# EAGLE schematic Goethe_Stromfluss (EAGLE 7.7.0)
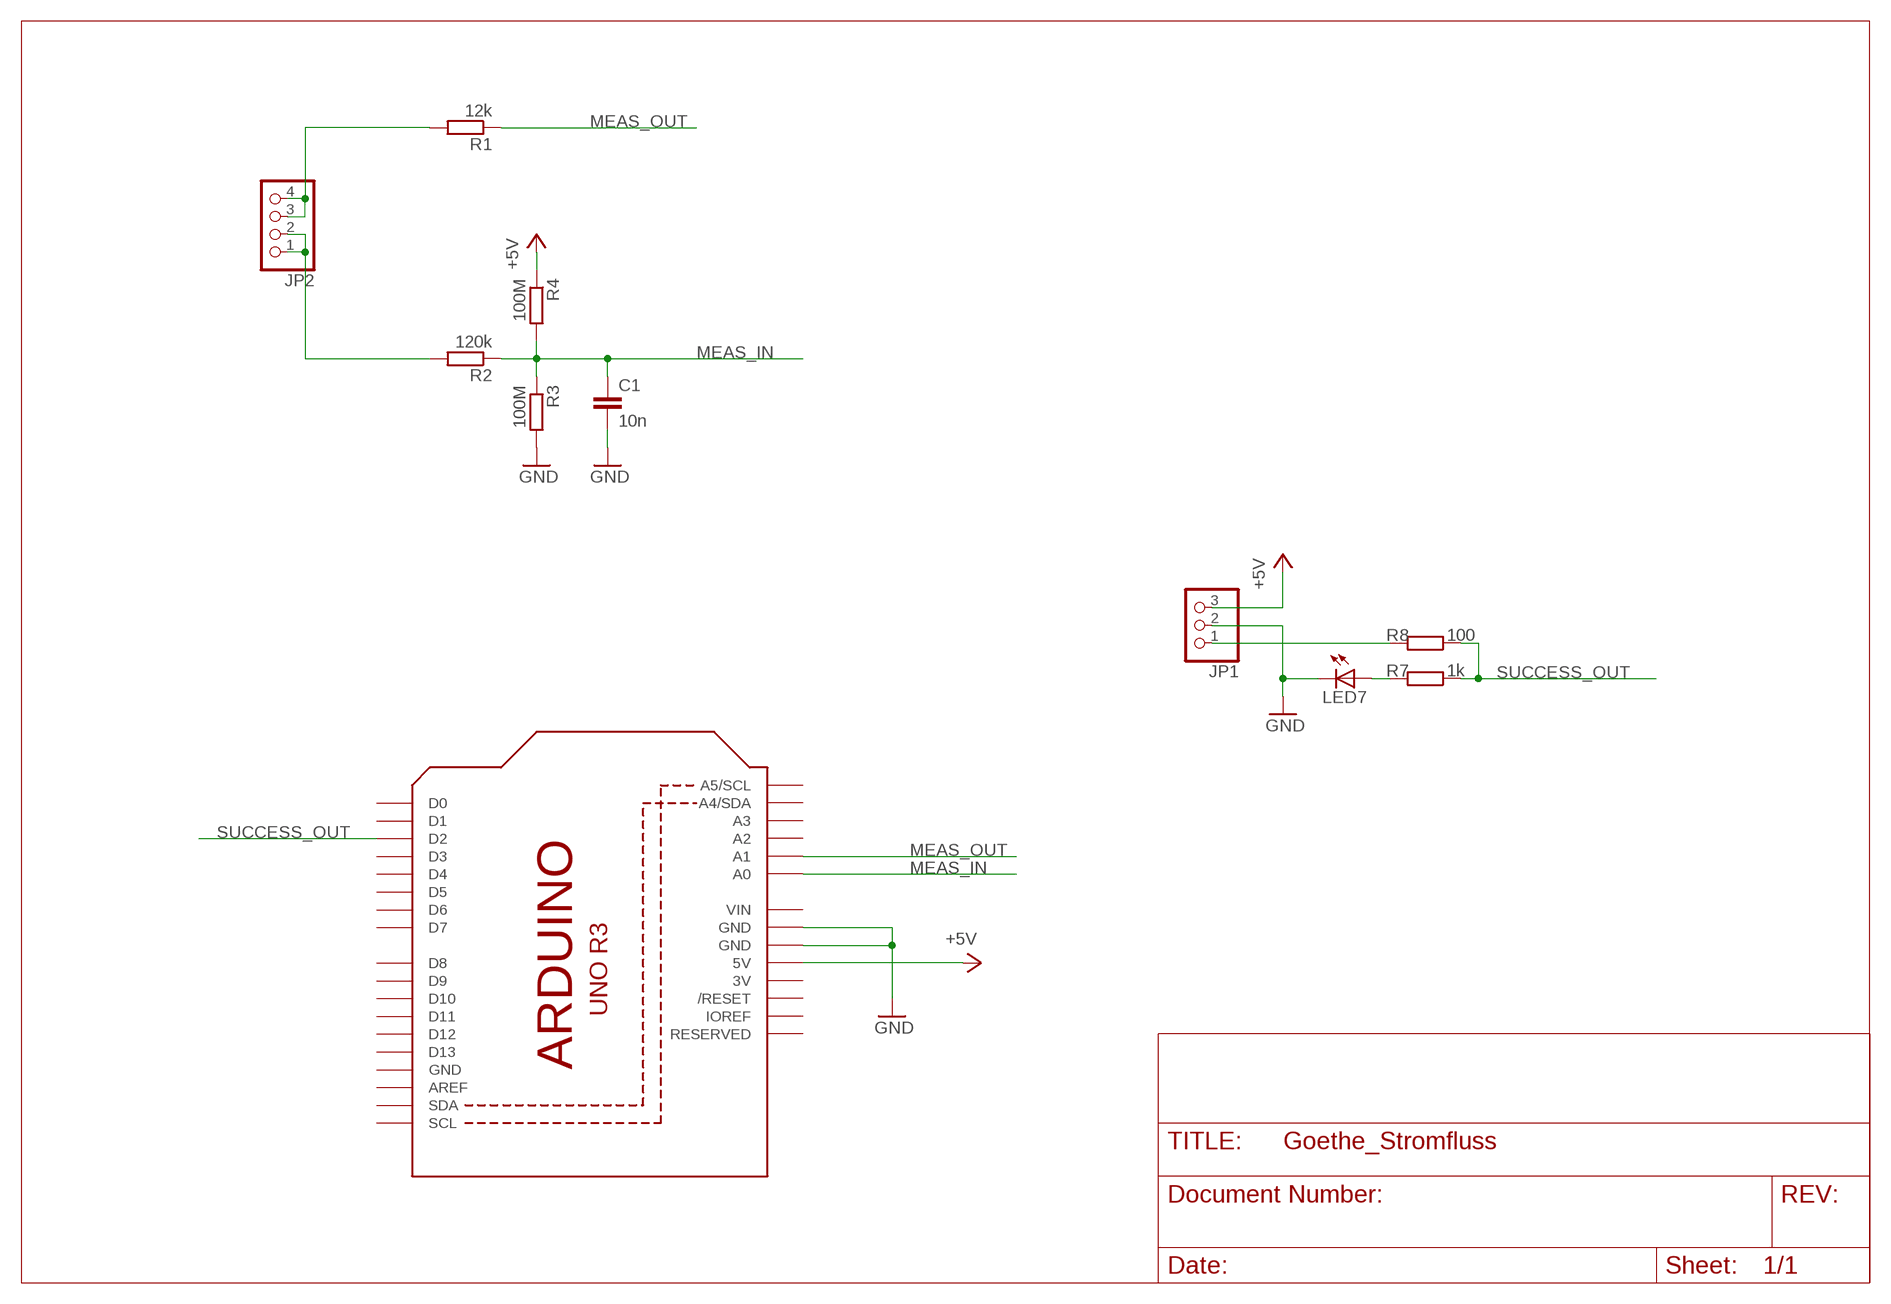
[diagram p0: schematic, sheet 1]

## Parts
C1  10n  C-EU025-025X050  [C025-025X050]
JP1  PINHD-1X3/90  [1X03/90]
JP2  PINHD-1X4/90  [1X04/90]
LED7  LED3MM  [LED3MM]
M1  ARDUINO_R3_SMALL  [ARDUINOR3_SMALL]
R1  12k  R-EU_0204/7  [0204/7]
R2  120k  R-EU_0207/10  [0207/10]
R3  100M  R-EU_0204/7  [0204/7]
R4  100M  R-EU_0207/10  [0207/10]
R7  1k  R-EU_0204/7  [0204/7]
R8  100  R-EU_0207/12  [0207/12]

## Nets
+5V: JP1.3 M1.5V R4.1
GND: C1.2 JP1.2 LED7.K(C) M1.GND@1(GND) M1.GND@2(GND) R3.2
MEAS_IN: C1.1 M1.A0 R2.1 R3.1 R4.2
MEAS_OUT: M1.A1 R1.1
N$1: JP2.3 JP2.4 R1.2
N$2: JP1.1 R8.2
N$3: JP2.1 JP2.2 R2.2
N$8: LED7.A R7.2
SUCCESS_OUT: M1.D2 R7.1 R8.1
Unconnected: M1.A2 M1.A3 M1.A4(A4/SDA) M1.A5(A5/SCL) M1.AREF M1.D0 M1.D1 M1.D3 M1.D4 M1.D5 M1.D6 M1.D7 M1.D8 M1.D9 M1.D10 M1.D11 M1.D12 M1.D13 M1.IOREF M1.RESERVED M1.RESET(/RESET) M1.SCL M1.SDA

## Power pins joined to a net without a drawn wire
3V: M1.3V
GND: M1.GND
VIN: M1.VIN

## Library data of the parts
C1 = rcl:C-EU: CAPACITOR, European symbol
JP1 = pinhead:PINHD-1X3: PIN HEADER
JP2 = pinhead:PINHD-1X4: PIN HEADER
LED7 = led:LED: LED OSRAM: - CHIPLED LG R971, LG N971, LY N971, LG Q971, LY Q971, LO R971, LY R971 LH N974, LH R974 LS Q976, LO Q976, LY Q976 LO Q996 - Hyper CHIPLED LW Q18S LB Q993, LB Q99A, LB R99A - SideLED LS A670, LO A670, LY A670, LG A670, LP A670 LB A673, LV A673, LT A673, LW A673 LH A674 LY A675 LS A676, LA A676, LO A676, LY A676, LW A676 LS A679, LY A679, LG A679 - Hyper Micro SIDELED® LS Y876, LA Y876, LO Y876, LY Y876 LT Y87S - SmartLED LW L88C, LW L88S LB L89C, LB L89S, LG L890 LS L89K, LO L89K, LY L89K LS L896, LA L896, LO L896, LY L896 - TOPLED LS T670, LO T670, LY T670, LG T670, LP T670 LSG T670, LSP T670, LSY T670, LOP T670, LYG T670 LG T671, LOG T671, LSG T671 LB T673, LV T673, LT T673, LW T673 LH T674 LS T676, LA T676, LO T676, LY T676, LB T676, LH T676, LSB T676, LW T676 LB T67C, LV T67C, LT T67C, LS T67K, LO T67K, LY T67K, LW E67C LS E67B, LA E67B, LO E67B, LY E67B, LB E67C, LV E67C, LT E67C LW T67C LS T679, LY T679, LG T679 LS T770, LO T770, LY T770, LG T770, LP T770 LB T773, LV T773, LT T773, LW T773 LH T774 LS E675, LA E675, LY E675, LS T675 LS T776, LA T776, LO T776, LY T776, LB T776 LHGB T686 LT T68C, LB T68C - Hyper Mini TOPLED® LB M676 - Mini TOPLED Santana® LG M470 LS M47K, LO M47K, LY M47K Source: http://www.osram.convergy.de LUXEON: - LUMILED® LXK2-PW12-R00, LXK2-PW12-S00, LXK2-PW14-U00, LXK2-PW14-V00 LXK2-PM12-R00, LXK2-PM12-S00, LXK2-PM14-U00 LXK2-PE12-Q00, LXK2-PE12-R00, LXK2-PE12-S00, LXK2-PE14-T00, LXK2-PE14-U00 LXK2-PB12-K00, LXK2-PB12-L00, LXK2-PB12-M00, LXK2-PB14-N00, LXK2-PB14-P00, LXK2-PB14-Q00 LXK2-PR12-L00, LXK2-PR12-M00, LXK2-PR14-Q00, LXK2-PR14-R00 LXK2-PD12-Q00, LXK2-PD12-R00, LXK2-PD12-S00 LXK2-PH12-R00, LXK2-PH12-S00 LXK2-PL12-P00, LXK2-PL12-Q00, LXK2-PL12-R00 Source: www.luxeon.com KINGBRIGHT: KA-3528ASYC Source: www.kingbright.com
M1 = 00_sm_arduino:ARDUINO_R3
R1-R4 R7 R8 = rcl:R-EU_: RESISTOR, European symbol